# Altium schematic sheet [02] - MCU AND IMU.SchDoc
size A
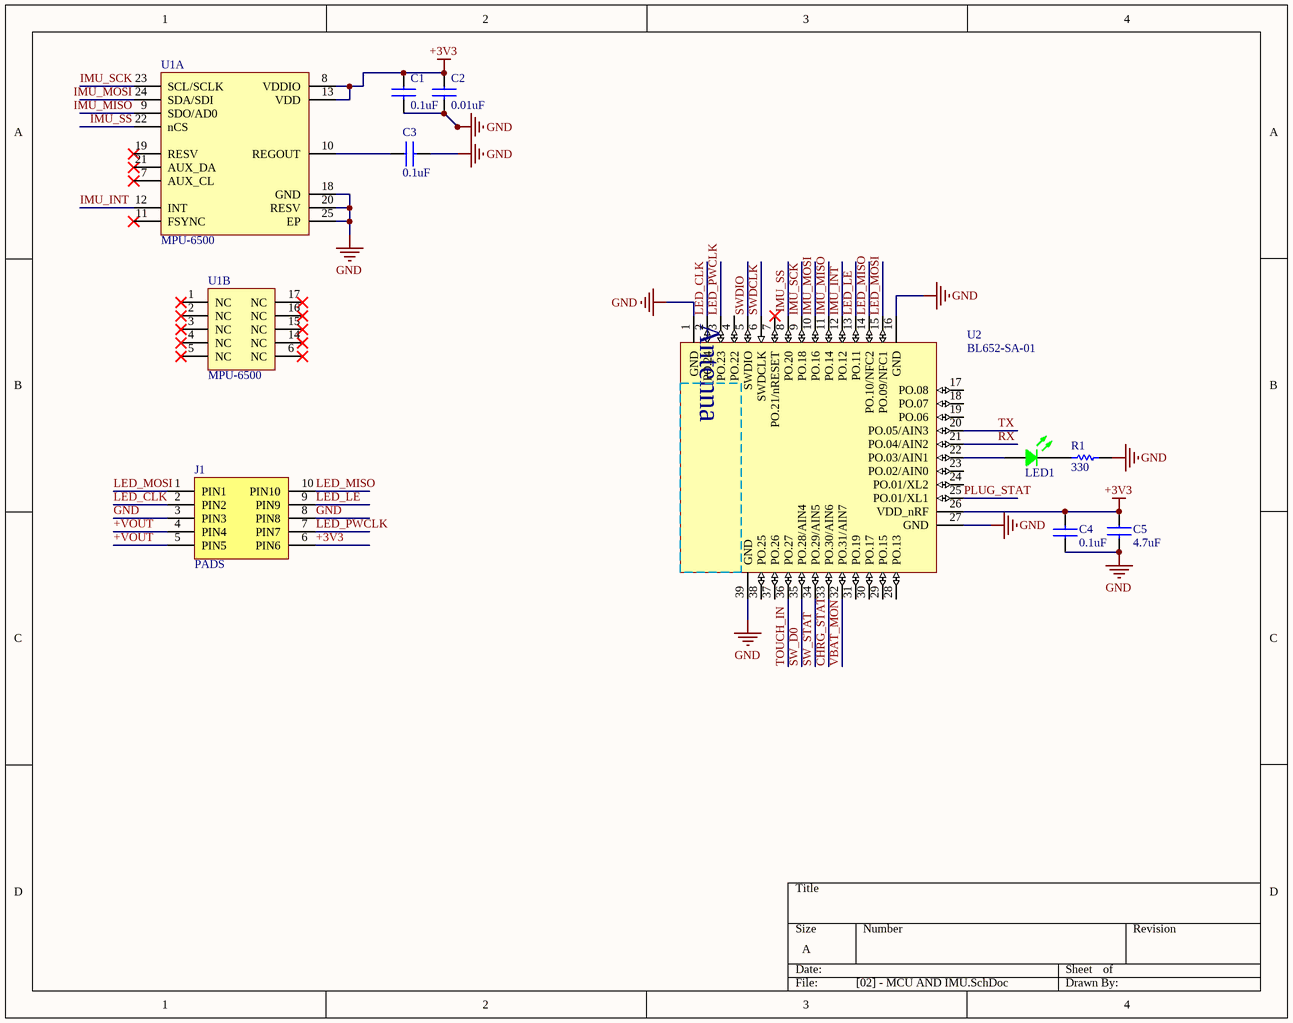
[diagram p0: [02] - MCU AND IMU.SchDoc]

## Parts
C1  0.1uF  [C0402]
C2  0.01uF  [C0402]
C3  0.1uF  [C0402]
C4  0.1uF  [C0402]
C5  4.7uF  [C0603]
J1  PADS  [Pads]
LED1  LTST-C193TGKT-5A  [LED 0603/1608 GREEN]  (value not drawn)
R1  330  [R0402]
U1  MPU-6500  [QFN-24]  (parts A,B of 2)
U2  BL652-SA-01  [BL652-SA-01]

## Nets
+3V3: C1.1 C2.1 C4.2 C5.1 J1.6(PIN6) U1.8(VDDIO) U1.13(VDD) U2.26(VDD_nRF)
GND: C1.2 C2.2 C3.2 C4.1 C5.2 J1.3(PIN3) J1.8(PIN8) R1.2 U1.18(GND) U1.20(RESV) U1.25(EP) U2.1(GND) U2.16(GND) U2.27(GND) U2.39(GND)
+VOUT: J1.4(PIN4) J1.5(PIN5)
CHRG_STAT: U2.33(PO.30/AIN6)
IMU_INT: U1.12(INT) U2.12(PO.12)
IMU_MISO: U1.9(SDO/AD0) U2.11(PO.14)
IMU_MOSI: U1.24(SDA/SDI) U2.10(PO.16)
IMU_SCK: U1.23(SCL/SCLK) U2.9(PO.18)
IMU_SS: U1.22(nCS) U2.8(PO.20)
LED_CLK: J1.2(PIN2) U2.2(PO.24)
LED_LE: J1.9(PIN9) U2.13(PO.11)
LED_MISO: J1.10(PIN10) U2.14(PO.10/NFC2)
LED_MOSI: J1.1(PIN1) U2.15(PO.09/NFC1)
LED_PWCLK: J1.7(PIN7) U2.3(PO.23)
PLUG_STAT: U2.25(PO.01/XL1)
RX: U2.21(PO.04/AIN2)
SW_D0: U2.35(PO.28/AIN4)
SW_STAT: U2.34(PO.29/AIN5)
SWDCLK: U2.6(SWDCLK)
SWDIO: U2.5(SWDIO)
TOUCH_IN: U2.36(PO.27)
TX: U2.20(PO.05/AIN3)
VBAT_MON: U2.32(PO.31/AIN7)
NetC3_1: C3.1 U1.10(REGOUT)
NetLED1_1: LED1.1 U2.22(PO.03/AIN1)
NetLED1_2: LED1.2 R1.1

Not connected (* = marked no-connect by the designer): U1 1(NC)* 2(NC)* 3(NC)* 4(NC)* 5(NC)* 6(NC)* 7(AUX_CL)* 11(FSYNC)* 14(NC)* 15(NC)* 16(NC)* 17(NC)* 19(RESV)* 21(AUX_DA)*; U2 4(PO.22) 7(PO.21/nRESET)* 17(PO.08) 18(PO.07) 19(PO.06) 23(PO.02/AIN0) 24(PO.01/XL2) 28(PO.13) 29(PO.15) 30(PO.17) 31(PO.19) 37(PO.26) 38(PO.25)

## Notes on the sheet
- (in symbol BL652-SA-01-T/R) Antenna

## Library data of the parts
C1 C3 C4 = CL05B104KO5NNNC: Cap Ceramic 0.1uF 16V X7R 10% SMD 0402 125C C/T; Manufacturer 1: Samsung; Description 1: Cap Ceramic 0.1uF 16V X7R 10% SMD 0402 125C Paper T/R; Capacitance: 100nF; Supplier 1: Digi-Key; Supplier Part Number 1: 1276-1001-6-ND; Manufacturer Part Number 1: CL05B104KO5NNNC; Stock 1: 9531; Pricing 1: 1=0.1, 10=0.018, 100=0.0081, 500=0.0058, 1000=0.0045, 2500=0.0041, 5000=0.0038 (USD); Mount: Surface Mount; Case/Package: 0402; Case Code (Metric): 1005; Case Code (Imperial): 0402; Material: Ceramic; Contact Plating: Tin; Min Operating Temperature: -55°C; Max Operating Temperature: 125°C; Tolerance: 10%; Package Quantity: 1; Packaging: Tape and Reel; Voltage Rating: 16V; Dielectric: X7R; Voltage: 16V; Voltage Rating (DC): 16V; Length: 1mm; Height: 0.5mm; Width: 0.02inch; Thickness: 0.022inch; Depth: 0.5mm; Radiation Hardening: No; Lead Free: Lead Free; ComponentLink1URL: https://datasheet.ciiva.com/16208/cl05b104kq5nnnc-16208343.pdf; ComponentLink1Description: https://datasheet.ciiva.com/16208/cl05b104kq5nnnc-16208343.pdf; ComponentLink2URL: https://datasheet.ciiva.com/26920/getdatasheetpartid-359683-26920169.pdf; ComponentLink2Description: https://datasheet.ciiva.com/26920/getdatasheetpartid-359683-26920169.pdf; ComponentLink3URL: https://datasheet.ciiva.com/26309/mlcc-catalogdownload2013-eng-26309003.pdf; ComponentLink3Description: https://datasheet.ciiva.com/26309/mlcc-catalogdownload2013-eng-26309003.pdf; ComponentLink4URL: https://datasheet.ciiva.com/29198/458718-da-01-en-vs-kondensator-0402-29198423.pdf; ComponentLink4Description: https://datasheet.ciiva.com/29198/458718-da-01-en-vs-kondensator-0402-29198423.pdf
C2 = GRM155R71E103KA01D: CAP CER 10000PF 25V X7R 0402; Manufacturer: Murata; Material: Ceramic; Capacitance: 10nF; Tolerance: 10%; Insulation Resistance: 10GR; Supplier 1: Digi-Key; Supplier Part Number 1: 490-1312-1-ND; Manufacturer Part Number: GRM155R71E103KA01D; Stock 1: 100000; Pricing 1: 1=0.1, 10=0.03, 100=0.0134, 500=0.00958, 1000=0.00753, 2500=0.00684, 5000=0.0063 (USD); Mount: Surface Mount; Case/Package: 0402; Number of Pins: 2; Case Code (Imperial): 0402; Case Code (Metric): 1005; Dielectric Material: Ceramic; Min Operating Temperature: -55°C; Max Operating Temperature: 125°C; Packaging: Tape and Reel; Voltage Rating: 25V; Voltage Rating (DC): 25V; Package Quantity: 1; Dielectric: X7R; Termination: SMD/SMT; Voltage: 25V; Length: 1mm; Height: 0.5mm; Width: 0.5mm; Thickness: 0.022inch; Depth: 0.5mm; Radiation Hardening: No; REACH SVHC: No SVHC; Lead Free: Lead Free; ComponentLink1URL: https://datasheet.ciiva.com/11786/0900766b807a1cab-11786320.pdf; ComponentLink1Description: https://datasheet.ciiva.com/11786/0900766b807a1cab-11786320.pdf; ComponentLink2URL: https://datasheet.ciiva.com/18184/getdatasheetpartid-161489-18184689.pdf; ComponentLink2Description: https://datasheet.ciiva.com/18184/getdatasheetpartid-161489-18184689.pdf; ComponentLink3URL: https://datasheet.ciiva.com/28534/1699889-28534148.pdf; ComponentLink3Description: https://datasheet.ciiva.com/28534/1699889-28534148.pdf; ComponentLink4URL: https://datasheet.ciiva.com/7937/1747448-7937621.pdf; ComponentLink4Description: https://datasheet.ciiva.com/7937/1747448-7937621.pdf; ComponentLink5URL: https://datasheet.ciiva.com/16199/product-16199034.pdf; ComponentLink5Description: https://datasheet.ciiva.com/16199/product-16199034.pdf; ComponentLink6URL: https://datasheet.ciiva.com/3777/3813grm155r71e103ka0123-3777115.pdf; ComponentLink6Description: https://datasheet.ciiva.com/3777/3813grm155r71e103ka0123-3777115.pdf; ComponentLink7URL: https://datasheet.ciiva.com/129/partnumbering-e-01-129741.pdf; ComponentLink7Description: https://datasheet.ciiva.com/129/partnumbering-e-01-129741.pdf; ComponentLink8URL: https://datasheet.ciiva.com/129/partnumbering-e-01-129742.pdf; ComponentLink8Description: https://datasheet.ciiva.com/129/partnumbering-e-01-129742.pdf; ComponentLink9URL: https://datasheet.ciiva.com/129/partnumbering-e-01-129743.pdf; ComponentLink9Description: https://datasheet.ciiva.com/129/partnumbering-e-01-129743.pdf; ComponentLink10URL: https://datasheet.ciiva.com/29199/454154-da-01-en-vs-kondensator-0402-29199817.pdf; ComponentLink10Description: https://datasheet.ciiva.com/29199/454154-da-01-en-vs-kondensator-0402-29199817.pdf
C5 = CC0603KRX5R6BB475: 4.7µF ±10% 10V X5R Ceramic Capacitor -55°C ~ 85°C Surface Mount, MLCC 0603 (1608 Metric) 0.063" L x 0.031" W (1.60mm x 0.80mm); Manufacturer 1: Yageo; Supplier 1: Digi-Key; Supplier Part Number 1: 311-1455-6-ND; Manufacturer Part Number 1: CC0603KRX5R6BB475; Description 1: 4.7µF ±10% 10V X5R Ceramic Capacitor -55°C ~ 85°C Surface Mount, MLCC 0603 (1608 Metric) 0.063" L x 0.031" W (1.60mm x 0.80mm); Stock 1: 166715; Pricing 1: 1=0.16, 10=0.115, 100=0.0543, 500=0.0381, 1000=0.0315 (USD); Mount: Surface Mount; Case/Package: 0603; Case Code (Imperial): 0603; Case Code (Metric): 1608; Min Operating Temperature: -55°C; Max Operating Temperature: 85°C; Capacitance: 4.7uF; Voltage Rating: 10V; Voltage Rating (DC): 10V; Tolerance: 10%; Packaging: Tape and Reel; Package Quantity: 1; Dielectric: X5R; Termination: SMD/SMT; Composition: Ceramic; Length: 1.6mm; Height: 0.8mm; Width: 0.8mm; Thickness: 0.035inch; Depth: 0.8mm; Radiation Hardening: No; REACH SVHC: Unknown; Lead Free: Lead Free; Halogen Free: Halogen Free; ComponentLink1URL: https://datasheet.ciiva.com/8033/1525783-8033798.pdf; ComponentLink1Description: https://datasheet.ciiva.com/8033/1525783-8033798.pdf; ComponentLink2URL: https://datasheet.ciiva.com/179/mlccorderingcode-179704.pdf; ComponentLink2Description: https://datasheet.ciiva.com/179/mlccorderingcode-179704.pdf; ComponentLink3URL: https://datasheet.ciiva.com/179/mlccorderingcode-179705.pdf; ComponentLink3Description: https://datasheet.ciiva.com/179/mlccorderingcode-179705.pdf; ComponentLink4URL: https://datasheet.ciiva.com/179/mlccorderingcode-179706.pdf; ComponentLink4Description: https://datasheet.ciiva.com/179/mlccorderingcode-179706.pdf; ComponentLink5URL: https://datasheet.ciiva.com/8033/1525783-8033802.pdf; ComponentLink5Description: https://datasheet.ciiva.com/8033/1525783-8033802.pdf; ComponentLink6URL: https://datasheet.ciiva.com/11586/upy-gphc-x5r-4v-to-50v-12-11586314.pdf; ComponentLink6Description: https://datasheet.ciiva.com/11586/upy-gphc-x5r-4v-to-50v-12-11586314.pdf; ComponentLink7URL: https://datasheet.ciiva.com/16623/upy-gphc-x5r-4v-to-50v-12-16623983.pdf; ComponentLink7Description: https://datasheet.ciiva.com/16623/upy-gphc-x5r-4v-to-50v-12-16623983.pdf
LED1 = LTST-C193TGKT-5A: LED GREEN CLEAR 0603 SMD; Manufacturer 1: Vishay Lite-On; Lens Colour: Clear,Colorless; Forward Current: 5mA; Forward Voltage: 3.1V; Luminous Intensity: 280mcd; Viewing Angle: 130°; Lens Style: Diffused,Colorless,Rectangular; Dominant Wavelength: 535nm; Number of Elements: 1; Power Dissipation: 76mW; Reverse Voltage: 5V; Supplier 1: Digi-Key; Supplier Part Number 1: 160-1832-6-ND; Manufacturer Part Number 1: LTST-C193TGKT-5A; Description 1: LED GREEN CLEAR 0603 SMD; Stock 1: 40414; Pricing 1: 1=0.51, 10=0.37, 25=0.302, 100=0.2415, 250=0.2038, 500=0.1736, 1000=0.1358, 2500=0.1245 (USD); Mount: Surface Mount; Case/Package: 0603; Number of Pins: 2; Colour: Green; Case Code (Metric): 1608; Case Code (Imperial): 0603; Min Operating Temperature: -20°C; Max Operating Temperature: 80°C; Package Quantity: 3000; Packaging: Tape and Reel; Illumination Colour: Green; Lens Transparency: Clear; Test Current: 5mA; Number of LEDs: 1; Length: 1.6mm; Height: 0.35mm; Width: 0.8mm; Depth: 0.8mm; Radiation Hardening: No; Lead Free: Lead Free; ComponentLink1URL: https://datasheet.ciiva.com/11775/0900766b80dc0555-11775617.pdf; ComponentLink1Description: https://datasheet.ciiva.com/11775/0900766b80dc0555-11775617.pdf; ComponentLink2URL: https://datasheet.ciiva.com/2111/ltst-c193tgkt-5a-2111818.pdf; ComponentLink2Description: https://datasheet.ciiva.com/2111/ltst-c193tgkt-5a-2111818.pdf; ComponentLink3URL: https://datasheet.ciiva.com/4689/lite-on-ltst-c193tgkt-5a-187259-4689610.pdf; ComponentLink3Description: https://datasheet.ciiva.com/4689/lite-on-ltst-c193tgkt-5a-187259-4689610.pdf; ComponentLink4URL: https://datasheet.ciiva.com/2111/p-100-ltst-c193tgkt-5a-2111819.pdf; ComponentLink4Description: https://datasheet.ciiva.com/2111/p-100-ltst-c193tgkt-5a-2111819.pdf; ComponentLink5URL: https://datasheet.ciiva.com/2111/p-100-ltst-c193tgkt-5a-2111820.pdf; ComponentLink5Description: https://datasheet.ciiva.com/2111/p-100-ltst-c193tgkt-5a-2111820.pdf
R1 = RC0402FR-07330RL: RES SMD 330 OHM 1% 1/16W 0402; Manufacturer: Yageo; Resistance: 330R; Temperature Coefficient: 100ppm/°C; Power Rating: 62.5mW; Voltage Rating: 50V; Max Power Dissipation: 63mW; Supplier 1: Digi-Key; Supplier Part Number 1: 311-330LRCT-ND; Manufacturer Part Number: RC0402FR-07330RL; RoHS: Yes; Category: Chip SMD Resistors; Stock 1: 310259; Pricing 1: 1=0.10000, 10=0.01500, 100=0.00620, 1000=0.00278, 2500=0.00242, 5000=0.00200 (USD); Case/Package: 0402; Case Code (Metric): 1005; Case Code (Imperial): 0402; Min Operating Temperature: -55°C; Max Operating Temperature: 155°C; Packaging: Tape and Reel; Tolerance: 1%; Package Quantity: 1; Composition: Thick Film; Number of Terminations: 2; Termination: SMD/SMT; Military Standard: Not; Features: Moisture Resistant; Length: 0.039inch; Height: 0.016inch; Width: 0.02inch; Depth: 0.5mm; REACH SVHC: Unknown; Lead Free: Lead Free; ComponentLink1URL: https://datasheet.ciiva.com/11819/0900766b80c66297-11819490.pdf?src-supplier=RSComponents; ComponentLink1Description: https://datasheet.ciiva.com/11819/0900766b80c66297-11819490.pdf?src-supplier=RSComponents; ComponentLink2URL: https://datasheet.ciiva.com/7849/1018594-7849962.pdf?src-supplier=Element14; ComponentLink2Description: https://datasheet.ciiva.com/7849/1018594-7849962.pdf?src-supplier=Element14; ComponentLink3URL: https://datasheet.ciiva.com/17083/pyu-rc0402-51-rohs-l-6-r-17083994.pdf?src-supplier=Future+Electronics; ComponentLink3Description: https://datasheet.ciiva.com/17083/pyu-rc0402-51-rohs-l-6-r-17083994.pdf?src-supplier=Future+Electronics; ComponentLink4URL: https://datasheet.ciiva.com/7849/1018594-7849963.pdf?src-supplier=Element14; ComponentLink4Description: https://datasheet.ciiva.com/7849/1018594-7849963.pdf?src-supplier=Element14; ComponentLink5URL: https://datasheet.ciiva.com/2453/pyu-r-int-thick-7-2453661.pdf?src-supplier=Digi-Key; ComponentLink5Description: https://datasheet.ciiva.com/2453/pyu-r-int-thick-7-2453661.pdf?src-supplier=Digi-Key; ComponentLink6URL: https://datasheet.ciiva.com/2453/pyu-r-int-thick-7-2453662.pdf?src-supplier=Digi-Key; ComponentLink6Description: https://datasheet.ciiva.com/2453/pyu-r-int-thick-7-2453662.pdf?src-supplier=Digi-Key; ComponentLink7URL: https://datasheet.ciiva.com/2453/pyu-r-int-thick-7-2453663.pdf?src-supplier=Digi-Key; ComponentLink7Description: https://datasheet.ciiva.com/2453/pyu-r-int-thick-7-2453663.pdf?src-supplier=Digi-Key; ComponentLink8URL: https://datasheet.ciiva.com/12656/pyu-rc0402-51-rohs-l-6-r-12656815.pdf?src-supplier=Mouser; ComponentLink8Description: https://datasheet.ciiva.com/12656/pyu-rc0402-51-rohs-l-6-r-12656815.pdf?src-supplier=Mouser
U1 = MPU-6500: GYRO/ACCELEROMETER 6AXIS 24QFN; Manufacturer: TDK InvenSense; Sensor Type: Accelerometer,Gyroscope; Output Type: Digital; Operating Supply Voltage: 3.45V; Supplier 1: Digi-Key; Supplier Part Number 1: 1428-1011-1-ND; Manufacturer Part Number: MPU-6500; Stock 1: 29119; Pricing 1: 1=8.31, 5=7.288, 10=6.559, 25=5.83, 50=5.3928, 100=4.664, 500=4.3725, 1000=4.081 (USD); Mount: Surface Mount; Case/Package: QFN; Number of Pins: 24; Min Operating Temperature: -40°C; Max Operating Temperature: 85°C; Package Quantity: 5000; ComponentLink1URL: http://store.invensense.com/Datasheets/invensense/RM-MPU-6500A-00.pdf; ComponentLink1Description: http://store.invensense.com/Datasheets/invensense/RM-MPU-6500A-00.pdf
U2 = BL652-SA-01-T/R: Manufacturer: Laird; Supplier 1: Digi-Key; Supplier Part Number 1: BL652-SA-01-CT-ND; Manufacturer Part Number: BL652-SA-01-T/R; Stock: 7566; Pricing: 1=7.45 (USD); Case/Package: Module